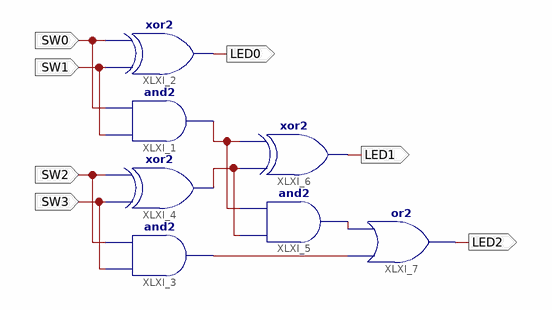
[diagram p0: schematic sheet 1]
// Xilinx ISE schematic Adder.sch (spartan6) as structural Verilog: 7 symbols, 7 ports
module Adder (
  input  SW1,
  input  SW0,
  input  SW3,
  input  SW2,
  output LED0,
  output LED1,
  output LED2
);

  wire XLXN_5, XLXN_6, XLXN_8, XLXN_9;

  and XLXI_1 (XLXN_6, SW1, SW0);
  xor XLXI_2 (LED0, SW1, SW0);
  and XLXI_3 (XLXN_8, SW3, SW2);
  xor XLXI_4 (XLXN_5, SW3, SW2);
  or XLXI_7 (LED2, XLXN_8, XLXN_9);
  xor XLXI_6 (LED1, XLXN_5, XLXN_6);
  and XLXI_5 (XLXN_9, XLXN_5, XLXN_6);
endmodule
